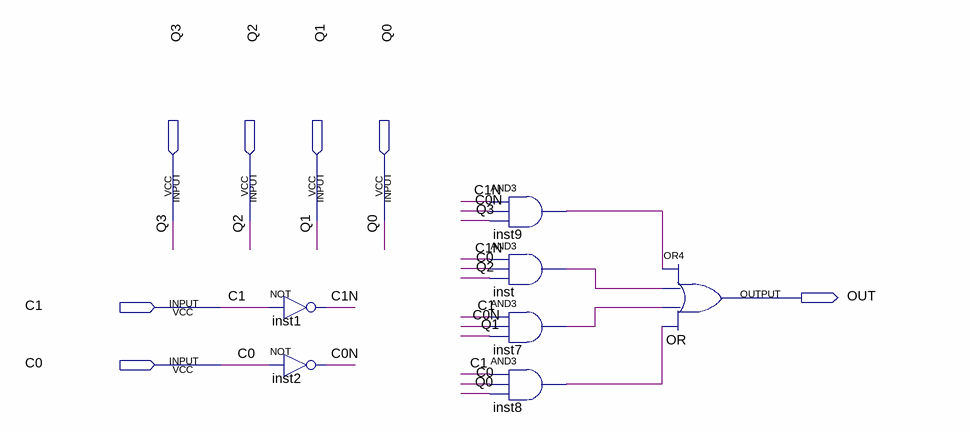
[diagram p0: schematic sheet]
// Quartus schematic Mux4.bdf as structural Verilog: 7 symbols, 7 pins
module Mux4 (
  input  Q3,
  input  Q2,
  input  Q1,
  input  Q0,
  input  C1,
  input  C0,
  output OUT
);

  wire C0N, C1N, inst7_out, inst8_out, inst9_out, inst_out;

  not inst1 (C1N, C1);
  not inst2 (C0N, C0);
  and inst9 (inst9_out, C1N, C0N, Q3);
  and inst (inst_out, C1N, C0, Q2);
  and inst7 (inst7_out, C1, C0N, Q1);
  and inst8 (inst8_out, C1, C0, Q0);
  or OR (OUT, inst9_out, inst_out, inst7_out, inst8_out);
endmodule
